# EAGLE board batsim1_1 (EAGLE 7.7.0)
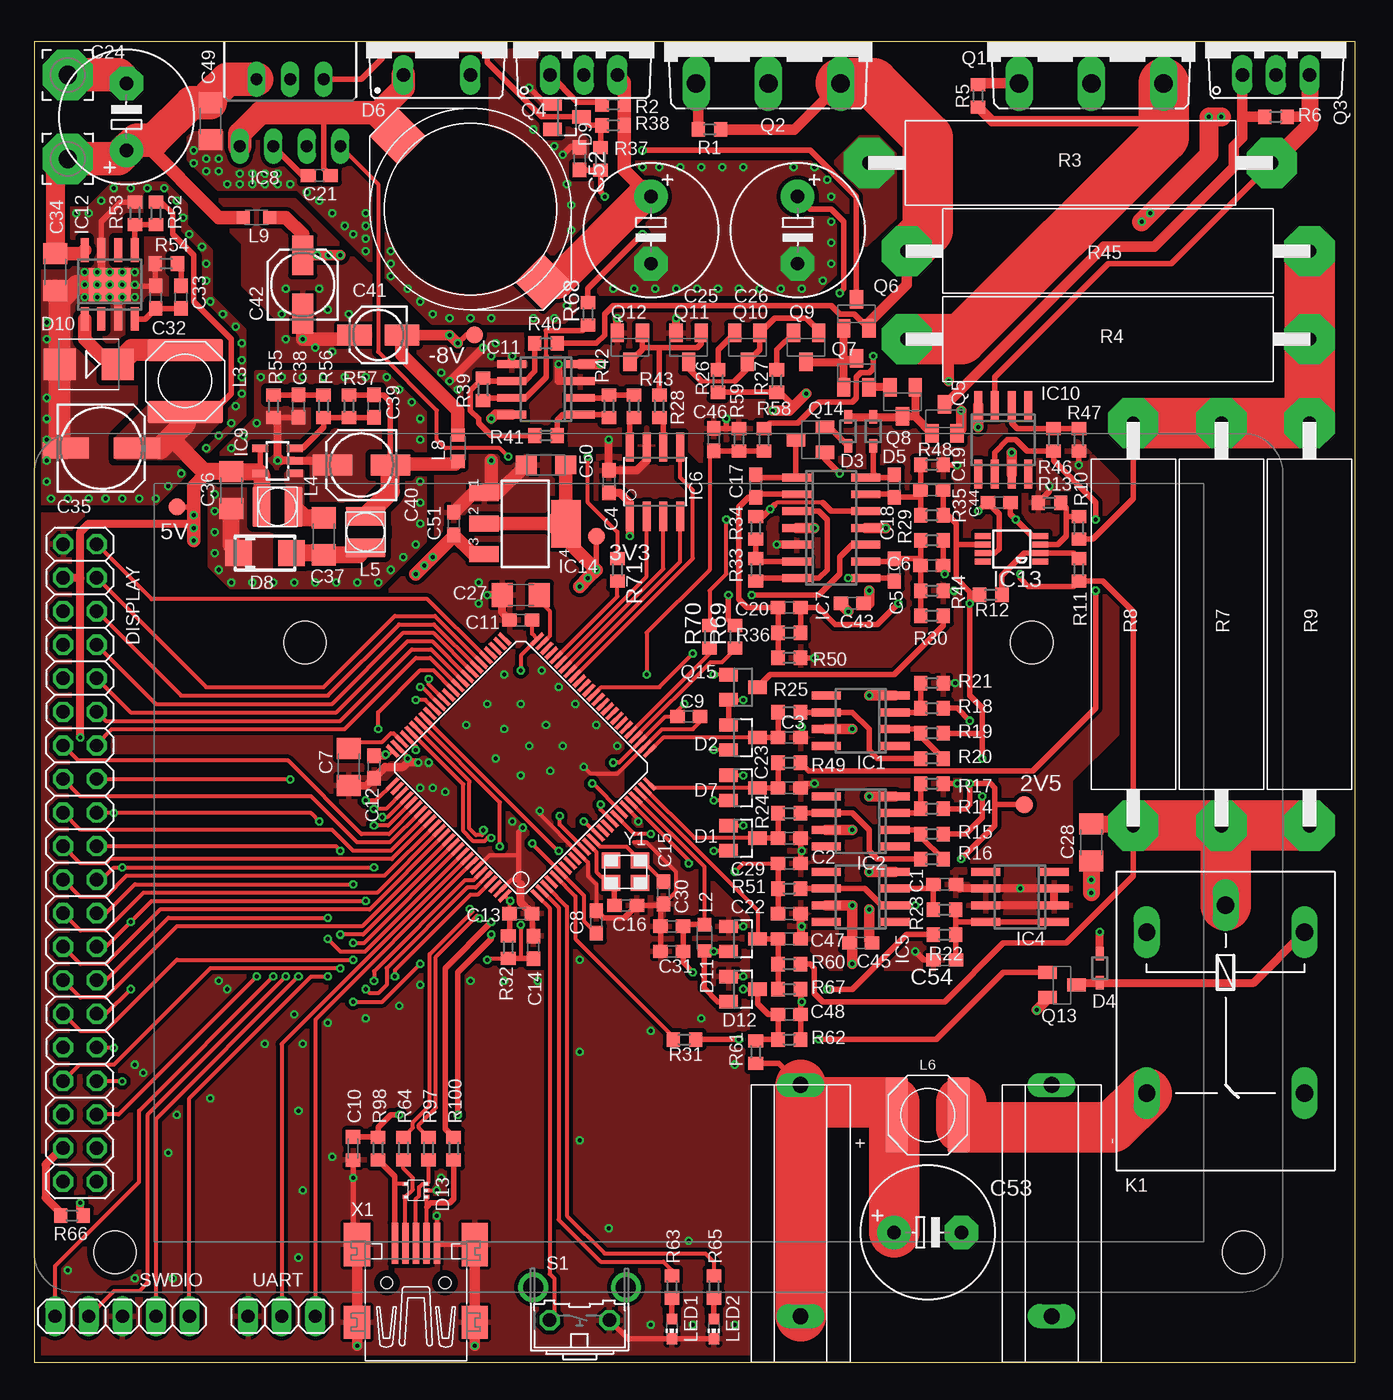
[diagram p4: board, top side]
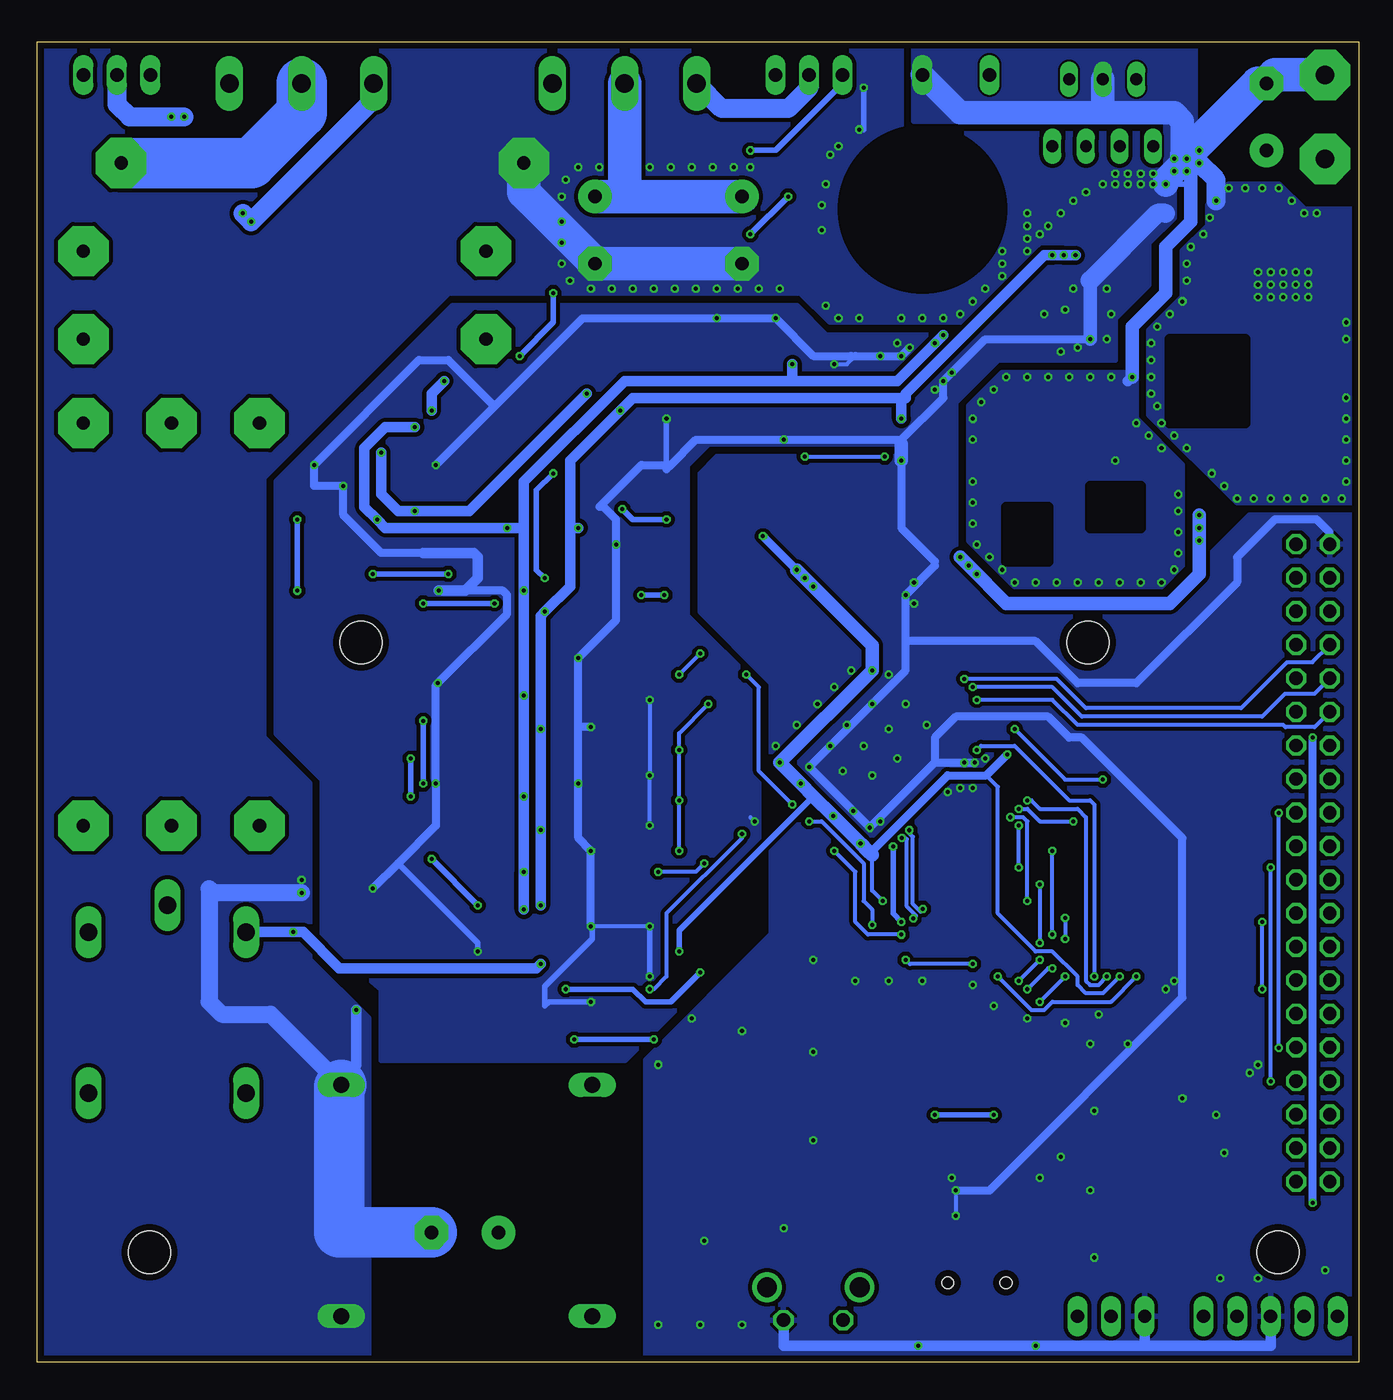
[diagram p5: board, bottom side, seen from below]

Size 100 x 100 mm. Coordinates in mm from the lower left corner, seen from the top.
Outline: 0,0 100,0 100,100 0,100 0,0
Copper layers (1*16): Top 0.035mm / dielectric 1.6mm / Bottom 0.035mm
Design rules "Elecrow_2-layer_PCB_eagle_rule *": minimum track width 6mil, minimum drill 12mil, track to track 6mil, track to pad 6mil, pad to pad 6mil, via to via 8mil, smd to smd 0mil, copper to edge 20mil, drill to drill 10mil, minimum pad ring 6mil, minimum via ring 6mil, stop-mask expansion 0mil, vias tented up to drill 100mil, thermal gap 10mil
Holes 3.2 mm at 20.5,54.5 75.5,54.5 91.52,8.33 6.11,8.33
tKeepout: area 72.5,51.5 to 78.5,57.5; area 17.5,51.5 to 23.5,57.5
tRestrict: area 8.3,73 to 14.3,75.6; area 26.9,81.2 to 39.1,93.4; area 18.1,63.2 to 18.7,66.4; area 23.5,62.5 to 26.7,63.2; area 17.5,51.5 to 23.5,57.5; area 72.5,51.5 to 78.5,57.5
bRestrict: area 8.6,71.1 to 14.3,77.5; area 26.9,81.2 to 39.1,93.4; area 16.5,63.2 to 20.3,66.4; area 23.5,60.6 to 26.7,64.8

## Footprints (pad centres in the part's own frame; a part is rotated, then mirrored left to right if it is on the bottom)
B1,27 = smd 1.27 x 1.27: TP 0,0
4MMJACK = drill 1.2 long: 1@1 0,0; 1@2 17.5,0
C0603 = smd 1.1 x 1: 1 -0.85,0; 2 0.85,0
C1206 = smd 1.6 x 1.8: 1 -1.4,0; 2 1.4,0
C0603K = smd 1.05 x 1.08: 1 -0.875,0; 2 0.875,0
E5-10,5 = drill 1.016 pad 2.54: + -2.54,0 | drill 1.016 pad 2.54 octagon: - 2.54,0
153CLV-0605 = smd 3.5 x 1.6: + 2.7,0; - -2.7,0
153CLV-0505 = smd 3 x 1.6: + 2.2,0; - -2.2,0
153CLV-0405 = smd 2.6 x 1.6: + 1.8,0; - -1.8,0
SMC_A = smd 1.6 x 1.4: + -1.5,0; - 1.5,0
SOT23 = smd 1 x 1.4: 1 -0.95,-1.1; 2 0.95,-1.1; 3 0,1.1
SOD323 = smd 1 x 0.6: 1 -1.1,0; 2 1.1,0
TO220ACS = drill 1.016 long: A 2.54,0; C -2.54,0
SMA = smd 2 x 2: A 2,0; C -2,0
SMB = smd 2.4 x 2.4: A 2.2,0; C -2.2,0
SOT-665 = smd 0.3 x 0.4: 1 -0.5,-0.8; 2 0,-0.8; 3 0.5,-0.8; 4 0.5,0.8; 5 -0.5,0.8
SAINSMART_TFT_3.2 = drill 1.016 octagon: 1 2.19,56.63; 2 4.73,56.63; 3 2.19,54.09; 4 4.73,54.09; 5 2.19,51.55; 6 4.73,51.55; 7 2.19,49.01; 8 4.73,49.01; 9 2.19,46.47; 10 4.73,46.47; 11 2.19,43.93; 12 4.73,43.93; 13 2.19,41.39; 14 4.73,41.39; 15 2.19,38.85; 16 4.73,38.85; 17 2.19,36.31; 18 4.73,36.31; 19 2.19,33.77; 20 4.73,33.77; 21 2.19,31.23; 22 4.73,31.23; 23 2.19,28.69; 24 4.73,28.69; 25 2.19,26.15; 26 4.73,26.15; 27 2.19,23.61; 28 4.73,23.61; 29 2.19,21.07; 30 4.73,21.07; 31 2.19,18.53; 32 4.73,18.53; 33 2.19,15.99; 34 4.73,15.99; 35 2.19,13.45; 36 4.73,13.45; 37 2.19,10.91; 38 4.73,10.91; 39 2.19,8.37; 40 4.73,8.37
SO08 = smd 0.6 x 2.2: 1 -1.905,-2.6; 2 -0.635,-2.6; 3 0.635,-2.6; 4 1.905,-2.6; 5 1.905,2.6; 6 0.635,2.6; 7 -0.635,2.6; 8 -1.905,2.6
SO8 = smd 0.6 x 2.2: 1 -1.905,-2.6; 2 -0.635,-2.6; 3 0.635,-2.6; 4 1.905,-2.6; 5 1.905,2.6; 6 0.635,2.6; 7 -0.635,2.6; 8 -1.905,2.6
SO08' = smd 0.61 x 2.21: 1 -1.905,-2.616; 2 -0.635,-2.616; 3 0.635,-2.616; 4 1.905,-2.616; 5 1.905,2.616; 6 0.635,2.616; 7 -0.635,2.616; 8 -1.905,2.616
SO14 = smd 0.6 x 2.2: 1 -3.81,-2.6; 2 -2.54,-2.6; 3 -1.27,-2.6; 4 0,-2.6; 5 1.27,-2.6; 6 2.54,-2.6; 7 3.81,-2.6; 8 3.81,2.6; 9 2.54,2.6; 10 1.27,2.6; 11 0,2.6; 12 -1.27,2.6; 13 -2.54,2.6; 14 -3.81,2.6
TO220-7 = drill 0.9 long: 1 -3.81,-5.08; 2 -2.54,0; 3 -1.27,-5.08; 4 0,0; 5 1.27,-5.08; 6 2.54,0; 7 3.81,-5.08
SOT23-5 = smd 0.55 x 1.2: 1 -0.95,-1.3; 2 0,-1.3; 3 0.95,-1.3; 4 0.95,1.3; 5 -0.95,1.3
HSOP8 = smd 0.6 x 1.8: 1 -1.905,-2.6; 2 -0.635,-2.6; 3 0.635,-2.6; 4 1.905,-2.6; 5 1.905,2.6; 6 0.635,2.6; 7 -0.635,2.6; 8 -1.905,2.6 | smd 3.2 x 2.51: EXP 0,0
UMAX8 = smd 0.45 x 1.2: 1 -0.975,-2.175; 2 -0.325,-2.175; 3 0.325,-2.175; 4 0.975,-2.175; 5 0.975,2.175; 6 0.325,2.175; 7 -0.325,2.175; 8 -0.975,2.175
SOT223 = smd 1.219 x 2.235: 1 -2.311,-3.099; 2 0,-3.099; 3 2.311,-3.099 | smd 3.6 x 2.2: 4 0,3.099
G5LE = drill 1.321 long: 1 -7.493,-5.969; 2 -7.493,5.969; O 4.699,5.969; P -9.525,0; S 4.699,-5.969
PISR = smd 3 x 3: 1 -7.8,0; 2 7.8,0
L2012C = smd 1 x 1: 1 -1,0; 2 1,0
L_NR60XX = smd 5.7 x 1.7: 1 0,2.35; 2 0,-2.35
L_1212 = smd 3 x 1.4: 1 0,1.2; 2 0,-1.2
CHIP-LED0603 = smd 0.8 x 0.8: A 0,-0.75; C 0,0.75
3,81/1,4 = drill 1.397 pad 3.81 octagon: 1 0,0
TOP3AV = drill 1.397 long: B -5.461,-3.175; C 0,-3.175; E 5.461,-3.175
TO220AV = drill 1.016 long: B -2.54,-2.54; C 0,-2.54; E 2.54,-2.54
SOT23-BEC = smd 1 x 1.4: B -0.95,-1.1; C 0,1.1; E 0.95,-1.1
R0603 = smd 1 x 1.1: 1 -0.85,0; 2 0.85,0
5WAXIAL = drill 1 pad 3.81 octagon: 1 15.24,0; 2 -15.24,0
B3F-31XX = drill 1.016 octagon: 1 -2.261,-1.245; 2 2.261,-1.245 | drill 1.499 pad 2.159: 3 -3.505,1.245; 4 3.505,1.245
1X05 = drill 1.016 long: 1 -5.08,0; 2 -2.54,0; 3 0,0; 4 2.54,0; 5 5.08,0
LQFP100_14 = smd 1.2 x 0.3: P$1 -7.75,6; P$2 -7.75,5.5; P$3 -7.75,5; P$4 -7.75,4.5; P$5 -7.75,4; P$6 -7.75,3.5; P$7 -7.75,3; P$8 -7.75,2.5; P$9 -7.75,2; P$10 -7.75,1.5; P$11 -7.75,1; P$12 -7.75,0.5; P$13 -7.75,0; P$14 -7.75,-0.5; P$15 -7.75,-1; P$16 -7.75,-1.5; P$17 -7.75,-2; P$18 -7.75,-2.5; P$19 -7.75,-3; P$20 -7.75,-3.5; P$21 -7.75,-4; P$22 -7.75,-4.5; P$23 -7.75,-5; P$24 -7.75,-5.5; P$25 -7.75,-6; P$51 7.75,-6; P$52 7.75,-5.5; P$53 7.75,-5; P$54 7.75,-4.5; P$55 7.75,-4; P$56 7.75,-3.5; P$57 7.75,-3; P$58 7.75,-2.5; P$59 7.75,-2; P$60 7.75,-1.5; P$61 7.75,-1; P$62 7.75,-0.5; P$63 7.75,0; P$64 7.75,0.5; P$65 7.75,1; P$66 7.75,1.5; P$67 7.75,2; P$68 7.75,2.5; P$69 7.75,3; P$70 7.75,3.5; P$71 7.75,4; P$72 7.75,4.5; P$73 7.75,5; P$74 7.75,5.5; P$75 7.75,6 | smd 0.3 x 1.2: P$26 -6,-7.75; P$27 -5.5,-7.75; P$28 -5,-7.75; P$29 -4.5,-7.75; P$30 -4,-7.75; P$31 -3.5,-7.75; P$32 -3,-7.75; P$33 -2.5,-7.75; P$34 -2,-7.75; P$35 -1.5,-7.75; P$36 -1,-7.75; P$37 -0.5,-7.75; P$38 0,-7.75; P$39 0.5,-7.75; P$40 1,-7.75; P$41 1.5,-7.75; P$42 2,-7.75; P$43 2.5,-7.75; P$44 3,-7.75; P$45 3.5,-7.75; P$46 4,-7.75; P$47 4.5,-7.75; P$48 5,-7.75; P$49 5.5,-7.75; P$50 6,-7.75; P$76 6,7.75; P$77 5.5,7.75; P$78 5,7.75; P$79 4.5,7.75; P$80 4,7.75; P$81 3.5,7.75; P$82 3,7.75; P$83 2.5,7.75; P$84 2,7.75; P$85 1.5,7.75; P$86 1,7.75; P$87 0.5,7.75; P$88 0,7.75; P$89 -0.5,7.75; P$90 -1,7.75; P$91 -1.5,7.75; P$92 -2,7.75; P$93 -2.5,7.75; P$94 -3,7.75; P$95 -3.5,7.75; P$96 -4,7.75; P$97 -4.5,7.75; P$98 -5,7.75; P$99 -5.5,7.75; P$100 -6,7.75
1X03 = drill 1.016 long: 1 -2.54,0; 2 0,0; 3 2.54,0
32005-301 = smd 3.1 x 0.5: 1 3,1.6; 2 3,0.8; 3 3,0; 4 3,-0.8; 5 3,-1.6 | smd 2.5 x 2: M1 -3,-4.45; M2 -3,4.45 | smd 3.3 x 2: M3 2.9,4.45; M4 2.9,-4.45 | hole 0.9: 0,2.2; 0,-2.2
3.2X2.5MM = smd 1.4 x 1.2: 1 -1.1,-0.85; 2 1.1,-0.85; 3 1.1,0.85; 4 -1.1,0.85

## Placement (x,y rotation side)
2V5  TPB1,27  [B1,27]  74.93,42.23 0 top
3V3  TPB1,27  [B1,27]  42.55,62.55 0 top
5V  TPB1,27  [B1,27]  10.79,64.77 0 top
+  [4MMJACK]  58,21 270 top
-  [4MMJACK]  77,21 270 top
-8V  TPB1,27  [B1,27]  33.34,77.79 0 top
C1  1u  [C0603]  68.9,36.2 0 top
C2  330p  [C0603]  57.15,39.69 0 top
C3  330p  [C0603]  57.15,47.31 0 top
C4  100n  [C0603]  43.5,66.67 270 top
C5  100p  [C0603]  65.09,60.01 270 top
C6  100p  [C0603]  67.94,60.33 0 top
C7  2u2  [C1206]  23.81,45.09 270 top
C8  100n  [C0603]  42.55,33.34 90 top
C9  100n  [C0603]  49.53,48.9 0 top
C10  100n  [C0603K]  24.13,16.19 270 top
C11  100n  [C0603]  36.83,56.2 180 top
C12  100n  [C0603]  25.72,45.09 270 top
C13  100n  [C0603]  36.83,33.97 0 top
C14  100n  [C0603]  37.78,31.43 90 top
C15  12p  [C0603]  47.62,35.56 90 top
C16  12p  [C0603]  44.77,34.61 180 top
C17  10n  [C0603]  54.61,66.36 90 top
C18  10n  [C0603]  65.09,66.36 90 top
C19  200p  [C0603]  67.94,66.04 0 top
C20  100p  [C0603]  57.15,57.15 0 top
C21  10n  [C0603]  21.59,89.85 0 top
C22  100n  [C0603]  57.15,33.97 0 top
C23  10n  [C0603]  57.15,43.5 0 top
C24  820u/35V  [E5-10,5]  6.99,94.3 90 top
C25  820u/35V  [E5-10,5]  46.67,85.72 270 top
C26  820u/35V  [E5-10,5]  57.78,85.72 270 top
C27  2u2  [C1206]  36.83,58.1 180 top
C28  100n  [C1206]  80.01,39.37 90 top
C29  1u  [C0603]  57.15,37.78 0 top
C30  100n  [C0603]  48.26,33.02 180 top
C31  1u  [C0603]  48.26,31.11 180 top
C32  220p  [C0603]  9.21,80.64 90 top
C33  22n  [C0603]  11.11,80.64 90 top
C34  10u/50V  [C1206]  1.59,82.55 90 top
C35  330u  [153CLV-0605]  5.08,69.22 0 top
C36  10u/50V  [C1206]  14.92,66.04 90 top
C37  1u/25V  [C1206]  21.91,62.55 90 top
C38  1u  [C0603]  20,72.39 270 top
C39  1n  [C0603]  25.72,72.39 270 top
C40  22u  [153CLV-0505]  24.77,67.94 180 top
C41  10u  [153CLV-0405]  26.04,77.79 180 top
C42  10u  [153CLV-0505]  20.32,81.6 90 top
C43  1u/50V  [C0603]  61.91,57.47 0 top
C44  1u/50V  [C0603]  73.03,65.09 0 top
C45  1u/50V  [C0603]  62.55,31.75 0 top
C46  1n5  [C0603]  51.44,69.85 90 top
C47  1n5  [C0603]  57.15,32.07 0 top
C48  330p  [C0603]  57.15,26.35 0 top
C49  470n/50V  [C1206]  13.34,93.98 270 top
C50  10µ  [SMC_A]  38.73,67.94 180 top
C51  100n  [C0603]  31.75,63.5 90 top
C52  1u  [C0603]  41.27,91.12 270 top
C53  220u  [E5-10,5]  67.63,9.84 0 top
C54  100n  [C0603]  68.9,30.48 180 top
D1  BAT54S  [SOT23]  53.66,39.69 270 top
D2  BAT54S  [SOT23]  53.66,47.31 270 top
D3  1N4148  [SOD323]  61.59,70.48 90 top
D4  1N4148  [SOD323]  80.64,29.84 270 top
D5  1N4148  [SOD323]  63.5,70.48 90 top
D6  MBR745  [TO220ACS]  30.48,97.47 0 top
D7  BAT54S  [SOT23]  53.66,43.5 270 top
D8  [SMA]  17.46,61.28 0 top
D9  BAT54S  [SOT23]  40.32,94.3 270 top
D10  B240F  [SMB]  4.13,75.56 180 top
D11  BAT54S  [SOT23]  53.66,32.07 270 top
D12  BAT54S  [SOT23]  53.66,28.26 270 top
D13  BZA900AVL  [SOT-665]  28.89,13.02 90 top
DISPLAY  SAINSMART_TFT_3.2  [SAINSMART_TFT_3.2]  0,5.32 0 top
IC1  OP07CR  [SO08]  62.55,48.58 90 top
IC2  OP07CR  [SO08]  62.55,40.96 90 top
IC4  TL431ACD  [SO8]  74.61,35.24 90 top
IC5  OP07CR  [SO08]  62.55,35.24 90 top
IC6  MCP4812  [SO08']  46.99,66.67 0 top
IC7  TL084D  [SO14]  60.33,63.18 270 top
IC8  LM2678T  [TO220-7]  19.37,97.16 0 top
IC9  LM2611  [SOT23-5]  18.41,68.26 90 top
IC10  OP07CR  [SO08]  73.34,69.85 180 top
IC11  TL072D  [SO08]  38.73,73.66 90 top
IC12  L5973D  [HSOP8]  5.71,81.6 0 top
IC13  MAX44241  [UMAX8]  73.98,61.59 90 top
IC14  [SOT223]  37.15,63.5 270 top
K1  G5LE  [G5LE]  90.17,25.08 270 top
L1  47u  [PISR]  33.02,87.31 315 top
L2  4u7  [L2012C]  50.72,32.14 90 top
L3  22u  [L_NR60XX]  11.43,74.3 0 top
L4  22u  [L_1212]  18.41,64.77 90 top
L5  22u  [L_1212]  25.08,62.87 180 top
L6  2u2/6.1A  [L_NR60XX]  67.63,18.73 270 top
L8  4u7  [L2012C]  32.07,69.22 90 top
L9  4u7  [L2012C]  16.83,86.68 0 top
LED1  [CHIP-LED0603]  48.26,2.54 180 top
LED2  [CHIP-LED0603]  51.44,2.54 180 top
PAD1  [3,81/1,4]  2.54,91.12 0 top
PAD2  [3,81/1,4]  2.54,97.47 0 top
Q1  TIP2955  [TOP3AV]  80.01,100.01 0 top
Q2  TIP3055  [TOP3AV]  55.56,100.01 0 top
Q3  TIP41C  [TO220AV]  93.98,100.01 0 top
Q4  TIP42C  [TO220AV]  41.59,100.01 0 top
Q5  BC807-40SMD  [SOT23-BEC]  68.9,71.44 0 top
Q6  BC817-40SMD  [SOT23-BEC]  62.23,79.38 0 top
Q7  BC817-40SMD  [SOT23-BEC]  62.23,74.93 0 top
Q8  BC807-40SMD  [SOT23-BEC]  65.72,72.71 180 top
Q9  BC807-40SMD  [SOT23-BEC]  58.42,76.83 180 top
Q10  BC807-40SMD  [SOT23-BEC]  53.98,76.83 180 top
Q11  BC817-40SMD  [SOT23-BEC]  49.53,76.83 180 top
Q12  BC817-40SMD  [SOT23-BEC]  45.09,76.83 180 top
Q13  BC817-40SMD  [SOT23-BEC]  77.79,28.57 270 top
Q14  BC807-40SMD  [SOT23-BEC]  58.74,69.85 90 top
Q15  BSS123  [SOT23]  53.66,51.12 270 top
R1  100  [R0603]  51.12,93.34 180 top
R2  1k5  [R0603]  43.81,95.25 0 top
R3  0.1/5W  [5WAXIAL]  81.28,84.14 0 top
R4  0.1/5W  [5WAXIAL]  81.28,77.47 180 top
R5  100  [R0603]  71.44,95.89 270 top
R6  1k5  [R0603]  93.98,94.3 0 top
R7  0.33/5W  [5WAXIAL]  89.85,55.88 270 top
R8  0.33/5W  [5WAXIAL]  83.19,55.88 270 top
R9  0.33/5W  [5WAXIAL]  96.52,55.88 270 top
R10  1k  [R0603]  79.06,63.18 270 top
R11  1k  [R0603]  79.06,60.01 270 top
R12  15k  [R0603]  72.39,58.1 0 top
R13  15k  [R0603]  76.83,65.09 0 top
R14  15k  [R0603]  67.94,41.91 0 top
R15  12k  [R0603]  67.94,40.01 0 top
R16  3k  [R0603]  67.94,38.1 0 top
R17  10k  [R0603]  67.94,43.81 0 top
R18  12k  [R0603]  67.94,49.53 0 top
R19  12k  [R0603]  67.94,47.62 0 top
R20  30k  [R0603]  67.94,45.72 0 top
R21  2k  [R0603]  67.94,51.44 0 top
R22  750  [R0603]  68.9,32.38 0 top
R23  10k  [R0603]  68.9,34.29 180 top
R24  3k3  [R0603]  57.15,41.59 0 top
R25  3k3  [R0603]  57.15,49.21 0 top
R26  1k  [R0603]  51.75,74.3 270 top
R27  1k  [R0603]  56.2,74.3 270 top
R28  1k  [R0603]  47.31,72.39 270 top
R29  12k  [R0603]  67.94,62.23 0 top
R30  2k  [R0603]  67.94,56.52 180 top
R31  10k  [R0603]  49.21,24.45 0 top
R32  10k  [R0603]  35.88,31.43 90 top
R33  100k  [R0603]  54.61,60.01 90 top
R34  100k  [R0603]  54.61,63.18 90 top
R35  1k  [R0603]  67.94,64.14 0 top
R36  1k  [R0603]  57.15,55.24 0 top
R37  910  [R0603]  42.86,91.12 90 top
R38  3k6  [R0603]  43.81,93.66 0 top
R39  10k  [R0603]  33.97,73.66 270 top
R40  36k  [R0603]  38.73,77.15 180 top
R41  36k  [R0603]  38.73,70.17 180 top
R42  20k  [R0603]  43.5,72.39 270 top
R43  10k  [R0603]  45.4,72.39 90 top
R44  12k  [R0603]  67.94,58.42 180 top
R45  0.1/5W  [5WAXIAL]  78.42,90.81 180 top
R46  100k  [R0603]  77.15,69.85 90 top
R47  1k  [R0603]  79.06,69.85 270 top
R48  1k  [R0603]  67.94,67.94 180 top
R49  10k  [R0603]  57.15,45.4 0 top
R50  1k  [R0603]  57.15,53.34 180 top
R51  47  [R0603]  57.15,35.88 0 top
R52  10k  [R0603]  9.21,87 90 top
R53  3k3  [R0603]  7.62,87 270 top
R54  4k7  [R0603]  10,83.19 0 top
R55  9k1  [R0603]  18.1,72.39 90 top
R56  1k  [R0603]  21.91,72.39 270 top
R57  56k  [R0603]  23.81,72.39 90 top
R58  100k  [R0603]  55.24,69.85 270 top
R59  10k  [R0603]  53.34,69.85 90 top
R60  75k  [R0603]  57.15,30.16 180 top
R61  360k  [R0603]  54.61,23.5 90 top
R62  47k  [R0603]  57.15,24.45 0 top
R63  1k  [R0603]  48.26,5.71 270 top
R64  22  [R0603]  27.94,16.19 90 top
R65  1k  [R0603]  51.44,5.71 270 top
R66  27  [R0603]  2.86,11.11 180 top
R67  10k  [R0603]  57.15,28.26 0 top
R68  91  [R0603]  41.91,79.38 90 top
R69  1k  [R0603]  53.02,54.93 90 top
R70  1k  [R0603]  51.12,54.93 90 top
R71  1k  [R0603]  44.13,60.01 270 top
R97  22  [R0603]  29.84,16.19 90 top
R98  10k  [R0603]  26.04,16.19 90 top
R100  22  [R0603]  31.75,16.19 90 top
S1  [B3F-31XX]  41.27,4.45 0 top
SWDIO  [1X05]  6.67,3.49 180 top
U$1  STM32F407X100  [LQFP100_14]  36.85,45.05 135 top
UART  [1X03]  18.73,3.49 0 top
X1  MINI-USB-SHIELD-32005-301  [32005-301]  28.89,6.03 90 top
Y1  CRYSTAL.3.2X2.5MM  [3.2X2.5MM]  44.77,37.15 180 top

## Tracks (layer width: path | path; a pad name or v marks a point on that pad's centre or on a via)
2.5V  (via drill 0.3)
  Top 0.406: R51.2 IC5.6 62.87,35.88 64.14,34.61 IC5.2 v66.67,34.61 | R14.2 70.48,41.91 70.8,42.23 v70.8,43.81 72.39,43.81 72.71,43.5 72.71,42.23 | v70.17,38.1 72.71,40.64 72.71,42.23 | R18.2 69.85,49.53 v70.8,48.58 | 2V5.TP 72.71,42.23
  Bottom 0.406: v70.8,43.81 v70.8,48.58 | v66.67,34.61 v70.17,38.1
+3V3  (via drill 0.3)
  Top 0.305: C11.1 37.68,55.17 U$1.P$50 36.83,53.52 v36.83,52.39 | U$1.P$75 26.77,45.94 C12.1 | C13.1 35.98,34.95 U$1.P$100 36.01,34.92 v36.04,34.92 | v43.81,45.4 44.27,45.4 U$1.P$28 47.77,48.9 C9.1 48.68,49.31 v49.21,49.85 | U$1.P$11 39.77,40.71 v39.77,41.35 | U$1.P$19 42.32,43.81 v42.23,43.81 | D1.2 v51.44,38.74 v51.44,38.73 | D2.2 v51.44,46.35 | D7.2 v51.44,42.55 | C8.1 41.59,33.44 41.59,35.35 U$1.P$6 37.7,39.24 v37.7,39.29 | SWDIO.5 1.59,7.3 7.94,13.65 7.94,19.05 v18.1,29.21
  Top 0.406: R32.2 35.98,32.38 C13.1 | D12.2 51.75,27.31 50.72,28.34 L2.1 50.75,31.12 D11.2 v51.44,31.11 50.8,31.11 | 3V3.TP v42.55,60.01
  Top 0.61: C4.2 44.35,65.83 45.09,65.09 IC6.1 v45.09,62.55 | C12.1 26.49,45.94 v26.59,46.04
  Top 1.016: IC14.2 39.05,63.5 | 39.05,63.5 v42.55,60.01 v41.91,59.37 v41.27,58.74 | C50.+ 40.23,64.68 39.05,63.5
  Bottom 0.305: v36.04,34.92 36.83,35.72 36.83,38.42 | v51.44,38.73 v51.44,42.55 v51.44,46.35 51.44,47.62 v49.21,49.85 | v18.1,29.21 19.37,27.94 20.64,27.94 21.27,28.57 21.27,29.21 23.18,31.11 24.45,31.11 27.3,33.97 27.3,43.58 28.18,44.45
  Bottom 0.406: v51.44,31.11 51.44,32.7 41.27,42.86
  Bottom 0.61: v45.09,62.55 v42.55,60.01 | 37.15,38.73 36.83,38.73 31.11,44.45 28.18,44.45 v26.59,46.04
  Bottom 1.016: 36.83,38.42 37.15,38.73 v37.7,39.29 v39.77,41.35 41.27,42.86 v42.23,43.81 v43.81,45.4 v36.83,52.39 36.83,54.29 v42.55,60.01
+5V  (via drill 0.3)
  Top 0.406: R52.2 9.63,87.84 10.48,87 10.48,85.41 12.06,83.82 12.06,80.33 14.92,77.47 14.92,73.34 13.34,71.75 11.62,71.75 L3.2 | IC9.5 IC9.4 | 5V.TP 12.06,64.77
  Top 0.61: R66.1 3.49,11.33 v3.49,12.06 | 3.49,59.37 3.49,62.87 4.13,63.5 11.75,63.5 v12.06,63.18 | 3.38,59.49 3.46,59.41 | v3.49,47.31 3.49,59.37 | DISPLAY.3 3.46,59.41 | 3.46,59.41 3.49,59.37
  Top 1.016: 12.89,67.44 12.89,67.18 12.06,66.36 12.06,64.77 v12.06,64.14 v12.06,63.18 v12.06,62.23 | IC14.3 33.21,61.19 C51.1 31.75,62.55 v29.53,60.33 v28.89,59.69
  Top 1.27: 10.32,70.01 12.89,67.44 C36.2 16.99,67.44 IC9.5 17.21,67.21 L4.1
  Top 1.676: 11.43,71.12 10.32,70.01 9.53,69.22
  Bottom 0.61: v3.49,12.06 v3.49,47.31
  Bottom 1.016: v12.06,64.14 12.06,59.69 14.29,57.47 26.67,57.47 v29.53,60.33 v30.16,60.96
  pour Top (isolate 0.305, no thermals): 6.35,69.85 8.89,72.39 13.97,72.39 13.97,71.44 11.11,68.58 6.35,68.58
+24V  (via drill 0.3)
  Top 0.406: R26.2 R27.2 56.41,73.44 57.47,72.39 | 72.39,64.87 C44.1 | C44.1 72.07,65.09 v71.44,64.45 | C44.1 73.03,64.24 73.03,61.59 72.7,61.27 IC13.7
  Top 0.61: D4.1 v80.64,32.58
  Top 0.813: IC11.8 34.92,71.75 v34.61,71.44 | IC1.7 v61.91,47.94 | IC2.7 v61.91,40.32 | IC5.7 v61.91,34.61 | v55.88,72.07 57.15,72.07 57.47,72.39 v58.42,73.34 | v73.98,68.9 IC10.7 | IC7.4 v59.05,63.18 | C43.1 61.06,57.37 v61.59,56.83 | C45.1 61.91,31.96 v61.91,34.61 | v61.91,30.16 v61.91,34.61 | C42.+ 20.34,83.82 v23.18,83.82
  Top 1.016: C42.+ 20.32,85.41 19.05,86.68 L9.2
  Bottom 0.813: 34.61,73.03 34.29,73.03 34.29,73.34 23.81,83.82 v23.18,83.82 v22.3,83.82 v21.43,83.82 | 34.61,73.03 54.93,73.03 v55.88,72.07 59.69,68.26 59.69,63.18 | 59.69,63.18 59.69,58.74 v61.59,56.83 61.91,56.52 v61.91,47.94 v61.91,40.32 v61.91,34.61 | v34.61,71.44 34.61,73.03 | v58.42,73.34 67.31,64.45 v71.44,64.45 72.71,64.45 73.98,65.72 v73.98,68.9 | v59.05,63.18 59.69,63.18 | K1.1 v80.64,32.58 79.88,32.58 77.15,29.84 62.23,29.84 v61.91,30.16
-8V  (via drill 0.3)
  Top 0.406: IC10.4 71.44,72.07 | C44.2 73.88,64.21 74.27,63.82 v74.3,63.82 | 74.3,63.79 v74.3,63.82 | -8V.TP 32.7,77.79 v32.07,77.15 | 74.61,63.5 v74.3,63.82 | IC13.4 75.54,62.57 v74.3,63.82
  Top 0.813: C41.- v31.43,77.79 v32.07,77.15 | IC11.4 v42.86,75.56 | IC1.4 v63.18,50.48 | IC2.4 v63.18,42.86 | IC5.4 v63.18,37.15 | v71.44,70.8 IC10.4 | IC7.11 v64.45,63.18 | C43.2 63.18,57.47 v63.18,58.42 | C45.2 63.18,31.96 v63.18,34.29
  Top 1.016: C41.- 27.84,76.31 32.07,72.07 L8.2
  Bottom 0.813: v31.43,77.79 34.92,74.3 42.86,74.3 | 42.86,74.3 55.56,74.3 63.18,66.67 63.18,63.18 | 63.18,63.18 v63.18,58.42 v63.18,50.48 v63.18,42.86 v63.18,37.15 v63.18,34.29 | v42.86,75.56 42.86,74.3 | 63.18,63.18 v64.45,63.18 73.66,63.18 v74.3,63.82 75.25,64.77 75.25,69.22 73.66,70.8 v71.44,70.8
ADC_BATTERY  (via drill 0.3)
  Top 0.305: U$1.P$18 45.42,40.01 v46.67,40.01 | v53.66,28.26 D12.3
  Top 0.406: D12.3 54.76,27.16 55.56,26.35 C48.1 R62.1 54.71,24.45 R61.2
  Bottom 0.305: v53.66,28.26 53.34,28.26 52.39,29.21 52.39,33.97 46.67,39.69 v46.67,40.01
ADC_BIAS_CURRENT
  Top 0.305: D7.3 46.88,43.5 U$1.P$25
  Top 0.406: D7.3 C23.1 R49.1
ADC_HIGH_CURRENT
  Top 0.305: D1.3 49.98,39.69 U$1.P$24
  Top 0.406: D1.3 C2.1 R24.1
ADC_LOW_CURRENT
  Top 0.305: D2.3 47.59,47.31 U$1.P$26
  Top 0.406: D2.3 C3.1 R25.1
ADC_PUSHPULL_OUT
  Top 0.305: U$1.P$23 54.76,34.21 D11.3
  Top 0.406: D11.3 C47.1 R60.2 R67.1
ADC_SUPPLY_HIGHSIDE  (via drill 0.3)
  Top 0.305: U$1.P$17 42.86,41.86 v42.86,42.23 | C46.1 51.12,68.68 51.12,60.01 46.35,55.24 v46.35,52.07
  Top 0.406: C46.1 R59.1 R58.2
  Bottom 0.305: v42.86,42.23 45.4,44.77 45.4,51.12 v46.35,52.07
BATTERY+
  Top 0.406: R61.1 56.35,22.64 +.1@1
  Top 2.54: L6.2 65.28,17.02 65.09,16.83
  Top 3.81: +.1@2 58,19.68 | 58,19.68 +.1@1 | 58,19.68 65.09,19.68 65.09,16.83 C53.+
BIAS_CTRL
  Top 0.406: IC6.6 47.62,71.22 R28.2
BIAS_CURRENT
  Top 0.61: Q7.B 61.28,75.88 | 61.28,75.88 Q6.B | Q7.C 62.08,75.88 61.28,75.88 | Q9.C 61.13,75.73 61.28,75.88
BUCK_ENABLE  (via drill 0.3)
  Top 0.305: IC8.7 26.04,89.22 26.04,76.52 30.48,72.07 30.48,69.85 31.11,69.22 35.24,69.22 v35.88,68.58 | v41.91,68.58 41.91,65.09 44.13,62.87 R71.1
  Bottom 0.305: v41.91,68.58 v35.88,68.58
CURRENT_CTRL  (via drill 0.3)
  Top 0.305: 59.69,65.09 56.2,65.09 56.04,64.93 | v52.39,63.82 52.39,59.69 51.12,58.42 R70.2
  Top 0.406: IC7.12 60.33,64.45 59.69,65.09 | 56.04,64.93 v55.72,64.61 55.14,64.03 R34.2
  Bottom 0.406: v52.39,63.82 54.93,63.82 v55.72,64.61
CURRENT_SENSE  (via drill 0.3)
  Top 0.406: C19.2 R35.2 69.14,64.14 69.77,63.5 69.77,61.91 | 69.77,61.91 69.77,59.37 70.8,58.34 70.8,58.1 | R36.2 C20.2 59.37,57.15 60.64,55.88 63.82,55.88 v65.41,57.47 | R19.2 71.75,47.62 | R15.2 70.48,40.01 71.75,41.27 v71.75,42.86 | v71.75,45.72 71.75,47.62 | 71.75,47.62 71.75,49.53 70.8,50.48 v70.8,57.47 70.8,58.1 | R12.1 70.8,58.1 | IC13.6 69.78,61.92 69.77,61.91
  Bottom 0.406: v65.41,57.47 v70.8,57.47 | v71.75,42.86 v71.75,45.72
DAC_CS
  Top 0.305: U$1.P$45 46.35,59.51 IC6.2
DAC_LDAC
  Top 0.305: U$1.P$42 49.85,60.88 49.85,66.04 48.9,66.99 IC6.5
DAC_SCK
  Top 0.305: U$1.P$44 47.62,60.07 IC6.3
DAC_SDI
  Top 0.305: U$1.P$43 48.9,60.63 IC6.4
GND  (via drill 0.3)
  Top 0.305: 28.26,45.4 28.26,45.86 U$1.P$74 | 36.83,36.2 36.51,36.51 36.09,36.51 U$1.P$99 | C9.2 50.38,48.48 49.85,47.94 47.52,47.94 U$1.P$27 44.13,44.55 42.12,44.55 v41.59,45.09 | U$1.P$20 45.72,41.12 v45.72,40.96 | Q15.2 v53.66,50.16 | v53.66,44.45 D7.1 | D1.1 v53.66,40.64 | U$1.P$94 34.46,38.42 36.67,38.42 | C15.1 48.58,35.66 48.58,37.15 46.35,39.37 45.4,39.37 | D11.1 v53.66,33.02 | C30.2 47.62,33.23 | D13.2 v30.48,13.02 | v30.48,11.11 30.48,9.04 X1.5 | v38.26,41.75 38.26,41.51 U$1.P$10 41.91,37.86 41.91,36.83 42.55,36.2 C8.2
  Top 0.406: R53.1 6.57,87.84 5.08,86.36 IC12.7 | R54.1 9.15,81.55 C32.2 5.82,81.5 IC12.EXP | C38.2 R55.1 | D9.1 38.74,95.25 v37.47,96.52 | R50.1 v59.05,53.34 | C23.2 58.32,43.81 v59.05,43.81 | C3.2 58.1,47.41 v58.1,48.1 | R48.1 v69.85,67.94 | R47.2 v79.06,67.94 | R21.2 v69.69,51.44 | R17.2 v69.85,43.81 | C29.2 58,38.63 v58.1,38.73 58,38.84 C2.2 | C46.2 52.28,70.7 52.39,70.8 | 52.39,70.8 v52.39,71.44 | R59.2 52.49,70.7 52.39,70.8 | C14.2 37.68,32.38 C13.2 | D2.1 Q15.2 | 36.51,36.51 36.67,36.67 36.67,38.42 36.67,40.16 v36.99,40.48 | 47.52,34.61 C16.1 44.66,33.66 43.08,33.66 C8.2 | 47.52,34.61 C15.1 | D12.1 v53.66,29.21 | C31.2 C30.2 47.41,34.49 47.52,34.61 | R62.2 C48.2 58,27.41 | X1.M4 30.59,8.93 X1.5 | LED2.C LED1.C 44.95,1.79 S1.2 | C10.2 24.13,9.24 X1.M3 | R44.1 v69.61,58.42 | R13.1 76.83,65.94 v76.83,66.36 | R67.2 58,27.41 | 58,27.41 v58.1,27.3 | v40.01,91.44 40.64,92.08 41.27,92.08 | C54.2 67.31,30.48 v66.67,31.11
  Top 0.61: IC12.7 5.08,81.92 v4.76,81.6 | IC12.3 6.35,80.96 IC12.EXP | C40.+ 22.25,68.26 IC9.2 18.73,68.26 18.41,68.58 18.41,71.22 R55.1 | IC6.7 46.35,68.26 45.62,67.53 C4.1 v43.5,69.85 | IC11.5 36.13,76.14 v36.2,76.2 | v33.97,76.83 v31.43,74.3 | IC11.3 39.69,74.3 v39.69,75.56 | Q12.E v44.13,79.06 | Q11.E v48.58,79.06 | IC7.5 v56.2,61.91 | IC4.7 IC4.2 IC4.3 v74.61,35.88 IC4.6 70.06,35.88 C1.2 | C47.2 58,32.92 v58.1,33.02 58,33.12 C22.2 | C7.2 25.17,43.69 C12.2 26.57,45.09 27.94,45.09 28.26,45.4 v29.05,45.4 | C13.2 36.83,34.82 36.83,36.2 | C11.2 35.43,56.75 C27.2 v34.29,58.1
  Top 0.813: Q13.E 76.69,27.48 v75.88,26.67 | X1.M3 X1.M2 v24.44,1.27 v24.45,1.27 | v33.34,1.27 X1.M1 X1.M4
  Top 1.016: C42.- v20.32,77.47 23.92,77.47 C41.+ | IC14.1 35.1,65.81 C50.- | IC14.1 34.61,66.37 v34.61,68.26 | C51.2 33.21,65.81 IC14.1
  Top 1.27: D8.C 14.92,61.82 C36.1 | C28.1 v80.01,35.56
  Top 1.422: IC12.EXP v4.76,81.6 3.2,81.6 1.93,80.33
  Top 1.676: C35.- 1.93,69.67 D10.A 1.93,80.33 1.93,80.81 C34.1
  Top 2.54: PAD2.1 6.35,97.47 C24.-
  Bottom 0.305: v45.72,40.96 46.04,41.27 | v53.66,50.16 v53.66,44.45 v53.66,40.64 | v53.66,33.02 v58.1,33.02 | v30.48,13.02 v30.48,11.11 | v39.69,75.56 38.73,75.56 38.1,76.2 | v36.2,76.2 38.42,76.2
  Bottom 0.406: 13.02,89.22 v14.61,89.22 | v37.47,96.52 37.47,93.34 v37.78,93.34 | v12.06,90.81 v12.06,91.76 12.7,91.76 13.34,92.39 C49.2 | v13.97,91.12 v13.02,91.12 | v52.39,71.44 52.39,67.63 | v53.66,29.21 v53.66,33.02 | v58.1,27.3 61.28,27.3 61.59,26.99 61.59,28.47 C47.2 58,32.92 v58.1,33.02 | v66.67,31.11 66.67,31.75 72.71,37.78
  Bottom 0.61: v33.97,76.83 v34.61,76.2 v36.2,76.2 38.1,76.2 38.42,76.2 41.27,76.2 v44.13,79.06 v48.58,79.06 58.74,79.06 65.25,72.55 | v20.32,77.47 28.26,77.47 v31.43,74.3 31.43,73.03 34.61,69.85 | 34.61,69.85 v43.5,69.85 50.16,69.85 52.07,67.94 | 52.39,67.63 52.07,67.94 | 59.05,48.1 v59.05,43.81 59.05,39.69 v58.1,38.73 v58.1,33.02 | 59.05,48.1 v59.05,53.34 56.2,56.2 v56.2,61.91 56.2,63.82 57.15,64.77 57.47,64.77 54.29,67.94 52.07,67.94 | v58.1,48.1 59.05,48.1 | v69.85,67.94 65.25,72.55 | 65.25,72.55 65.56,72.55 68.9,75.88 71.12,75.88 v79.06,67.94 79.06,66.36 v76.83,66.36 76.83,64.14 73.98,61.28 70.8,61.28 | v69.61,58.42 64.77,58.42 64.45,58.1 64.45,56.67 v69.69,51.44 69.85,51.28 v69.85,43.81 69.85,40.64 72.71,37.78 v74.61,35.88 | 34.61,69.85 34.61,69.53 | v34.61,68.26 34.61,63.18 32.07,60.64 32.07,60.33 v34.29,58.1 34.29,54.61 | 32.07,45.4 v36.99,40.48 v38.26,41.75 v41.59,45.09 34.29,52.39 34.29,54.61 | DISPLAY.1 2.19,62.83 3.17,63.82 6.35,63.82 9.21,60.96 9.21,59.05 16.83,51.44 21.27,51.44 24.45,54.61 34.29,54.61 | 32.07,45.4 v29.05,45.4 | v30.48,13.02 27.94,13.02 13.34,27.62 13.34,39.69 20.95,47.31 21.91,47.31 23.5,48.9 30.48,48.9 32.07,47.31 32.07,45.4
  Bottom 0.813: 17.46,74.3 v17.14,74.61 | v75.88,26.67 75.88,22.54 76.83,21.59 76.83,21.16 -.1@1 | SWDIO.3 6.67,1.27 16.19,1.27 | 16.19,1.27 v24.45,1.27 v33.34,1.27 43.5,1.27 43.5,3.16 S1.2 | UART.1 16.19,1.27 | v69.61,58.42 67.63,58.42 66.67,59.37 66.67,60.96 66.99,61.28 70.8,61.28
  Bottom 1.016: v17.14,74.61 17.14,78.42 14.61,80.96 14.61,84.45 12.7,86.36 12.7,91.76 | v20.32,77.47 20.32,81.92 | v34.61,68.26 34.61,69.53
  Bottom 1.27: v80.01,35.56 86.68,35.56 87,35.88 87,27.3 86.04,26.35 82.35,26.35 -.1@1
  Bottom 1.422: 14.61,87 15.24,87 20.32,81.92 | v10.79,87.95 10.79,89.53 v12.06,90.81
  Bottom 1.778: IC8.4 19.37,94.61 | D6.A 30.16,94.61 19.37,94.61 | 19.37,94.61 13.97,94.61 13.34,93.98 C49.2 13.34,91.44 v13.02,91.12
  Bottom 1.93: v13.02,91.12 v13.97,90.17 14.61,89.53 v14.61,89.22
  Bottom 2.54: C25.- C26.- 63.18,88.58 R45.1 | v13.02,91.12 13.02,91.44 12.7,91.76 7.62,96.84 C24.- 6.35,97.47 PAD2.1
  Bottom 3.81: C53.- 77.15,9.84 77.15,20.85 -.1@1
  other vias: 5.71,81.6 5.71,82.55 6.67,82.55 7.62,82.55 7.62,81.6 7.62,80.64 6.67,80.64 6.67,81.6 5.71,80.64 4.76,80.64 4.76,82.55 3.81,82.55 3.81,81.6 3.81,80.64 3.17,87 4.13,87 5.08,87.95 6.03,88.9 7.3,88.9 8.57,88.9 9.84,88.9 11.27,86.68 11.75,85.41 12.7,84.45 13.02,83.19 13.02,81.92 13.34,80.33 14.29,79.38 15.24,78.42 15.72,77.15 15.72,75.88 15.72,74.61 15.72,73.34 15.24,72.39 14.92,71.12 13.97,70.17 13.02,69.22 11.11,67.31 10.16,66.36 9.21,65.41 7.94,65.41 6.67,65.41 5.4,65.41 4.13,65.41 2.54,65.41 1.27,65.41 0.95,66.67 0.95,68.26 0.95,69.85 0.95,71.44 0.95,73.03 0.95,77.47 0.95,78.74 18.41,68.26 14.92,69.22 15.88,70.17 16.83,71.12 18.73,74.61 20.32,74.61 21.91,74.61 23.5,74.61 25.08,74.61 26.67,74.61 27.62,73.66 28.57,72.71 29.21,71.44 29.21,69.85 29.21,66.67 29.21,65.09 29.21,63.5 28.89,61.91 27.94,60.96 26.99,60.01 26.04,59.05 24.45,59.05 22.86,59.05 21.27,59.05 19.68,59.05 18.1,59.05 16.51,59.05 14.92,59.05 13.97,60.01 13.65,61.28 13.65,62.87 13.65,65.72 13.65,64.45 19.37,89.22 20.64,88.58 21.59,87.95 22.54,87 23.5,86.04 24.13,85.41 28.26,81.28 29.21,80.33 30.16,79.38 31.43,79.06 33.02,79.06 34.61,79.06 37.78,79.06 39.37,79.06 40.32,80.01 43.81,81.28 45.4,81.28 46.99,81.28 48.58,81.28 50.16,81.28 51.75,81.28 53.34,81.28 54.93,81.28 56.52,81.28 58.1,81.28 59.69,81.92 60.33,83.19 60.33,84.77 60.33,86.36 60.33,88.27 60.01,89.53 59.05,90.49 57.47,90.49 53.66,90.49 52.07,90.49 50.48,90.49 48.9,90.49 47.31,90.49 46.04,90.49 34.92,77.15 30.8,74.93 32.07,73.66 21.27,76.83 22.54,76.52 19.05,77.47 18.73,79.38 19.05,81.28 21.59,81.28 22.23,79.69 23.81,79.38 80.01,36.51 18.41,89.22 18.41,90.01 39.37,92.08 40.32,89.22 40.64,87.63 40.64,85.72 13.02,90.17 17.46,90.01 17.46,89.22 16.51,90.01 15.56,90.01 16.51,89.22 15.56,89.22 25.08,84.14 25.08,85.09 25.08,86.04 25.08,87 26.99,84.14 26.99,83.19 26.99,82.23 28.26,45.72 29.84,45.4 29.21,43.5 30.16,43.5 31.11,43.18 36.2,40.96 44.13,46.67 42.55,48.26 40.96,49.85 39.69,51.12 38.42,52.39 35.56,52.07 36.83,49.85 38.73,48.26 40.01,46.67 39.05,44.77 37.47,46.67 36.83,44.45 34.92,45.72 35.56,47.94 34.29,49.85 32.7,48.26 29.21,28.57 27.62,26.99 25.08,26.04 22.23,25.72 33.02,28.89 35.56,28.89 38.1,28.89 22.54,15.56 24.13,13.97 30.8,13.97 46.67,2.86 49.85,2.86 53.02,2.86 41.27,30.48 46.67,25.08 50.48,26.04 53.02,22.54 41.27,23.5 41.27,16.83 43.5,10.16 49.53,9.21 19.68,26.35 17.46,24.13 13.34,20 14.61,28.26 13.97,28.89 8.26,21.91 7.62,22.54 2.54,6.99 7.62,6.35 10.79,18.73 10.16,15.88 10.48,6.35 20.32,24.13 20,19.05 20.32,13.02 20,7.94 33.66,57.47 33.66,59.05
  pour Bottom (isolate 0.406, rank 3, no thermals): 0.32,87.31 4.13,87.31 6.03,89.22 9.84,89.22 11.43,87.63 11.43,86.04 13.34,84.14 13.34,80.64 15.88,78.11 15.88,71.75 9.21,65.09 0.32,65.09
  pour Top (isolate 0.406, rank 2, no thermals): 0.32,87.31 4.13,87.31 6.03,89.22 9.84,89.22 11.43,87.63 11.43,86.04 13.34,84.14 13.34,80.64 15.88,78.11 15.88,71.75 9.21,65.09 0.32,65.09
  pour Top (isolate 0.406, rank 3, no thermals): 13.34,67.94 16.83,71.44 16.83,74.93 26.99,74.93 29.53,72.39 29.53,62.23 26.04,58.74 14.92,58.74 13.34,60.33
  pour Bottom (isolate 0.406, rank 3, no thermals): 13.34,67.94 16.83,71.44 16.83,74.93 26.99,74.93 29.53,72.39 29.53,62.23 26.04,58.74 14.92,58.74 13.34,60.33
  pour Bottom (isolate 0.305, rank 2, no thermals): 15.24,93.03 34.61,93.03 34.61,99.69 38.1,99.69 38.1,96.2 43.5,90.81 60.64,90.81 62.55,92.71 63.82,92.71 65.09,91.44 65.09,86.68 59.05,80.96 42.23,80.96 40.01,78.74 30.16,78.74 20,88.9 15.24,88.9
  pour Bottom (isolate 0.305, rank 4): 13.97,88.9 20.32,88.9 24.45,84.77 23.5,84.77 23.18,84.45 29.84,77.79 40.32,77.79 42.55,80.01 68.58,80.01 81.92,66.67 81.92,47.62 78.42,44.13 78.42,32.38 75.88,29.84 73.98,28.26 73.98,22.86 55.56,22.86 45.4,33.02 45.4,51.12 50.8,56.52 50.8,67.94 49.21,69.53 33.66,69.53 27.3,75.88 18.41,75.88 18.41,79.06 15.88,81.6 15.88,84.77 13.97,86.68
  pour Top (isolate 0.305, rank 4): 13.97,87.95 19.68,87.95 29.84,77.79 40.32,77.79 42.55,80.01 68.58,80.01 81.92,66.67 81.92,47.62 78.42,44.13 78.42,32.38 75.88,29.84 60.33,29.84 54.93,35.24 54.93,63.82 49.21,69.53 33.66,69.53 27.3,75.88 18.41,75.88 18.41,79.06 15.88,81.6 15.88,84.77 13.97,86.68
  pour Bottom (isolate 0.305, rank 4, no thermals): 58.74,80.96 68.9,80.96 82.87,66.99 82.87,47.31 79.38,43.81 79.38,30.48 74.93,26.04 74.93,0.32 99.69,0.32 99.69,99.69 35.24,99.69 34.92,99.38 53.34,80.96
  pour Top (isolate 0.305, rank 2, no thermals): 12.06,93.03 34.61,93.03 34.61,99.69 38.1,99.69 38.1,96.2 43.5,90.81 60.64,90.81 62.55,92.71 63.82,92.71 65.09,91.44 65.09,86.68 59.05,80.96 42.23,80.96 40.01,78.74 30.16,78.74 20,88.9 13.97,88.9 11.75,91.12 11.75,92.71
  pour Bottom (no thermals): 14.61,90.81 14.61,93.98 33.66,93.98 33.66,99.69 12.38,99.69 12.38,92.08 12.06,91.76 13.02,90.81
  pour Bottom (isolate 0.305): 30.48,73.03 33.66,69.85 34.92,69.85 34.92,68.58 48.58,68.58 49.85,67.31 49.85,56.83 44.77,51.75 44.45,51.44 44.45,32.38 53.98,22.86 53.98,0.32 0.32,0.32 0.32,64.14 8.26,64.14 14.61,57.78 26.35,57.78 30.16,61.59 30.48,61.91
  pour Top (isolate 0.305): 30.48,73.03 33.66,69.85 34.92,69.85 34.92,68.58 48.58,68.58 49.85,67.31 49.85,56.83 44.45,51.44 44.45,43.18 53.98,33.66 53.98,0.32 0.32,0.32 0.32,64.14 8.26,64.14 14.61,57.78 26.35,57.78 30.48,61.91
HIGHSIDE_SUPPLY_CTRL
  Top 0.406: IC6.8 45.09,71.22 R43.1
LCD_CLK  (via drill 0.3)
  Top 0.305: U$1.P$78 26.64,41.91 v25.72,41.91 | v21.59,40.96 20.95,41.59 v6.03,41.59 4.77,41.59 DISPLAY.18 | DISPLAY.32 6,23.85 v6.03,23.81
  Bottom 0.305: v6.03,23.81 v6.03,41.59 | v25.72,41.91 25.08,41.91 24.13,40.96 v21.59,40.96
LCD_CS  (via drill 0.3)
  Top 0.305: U$1.P$95 33.26,36.51 32.62,36.51 25.72,29.61 v25.72,28.89 | DISPLAY.29 3.5,25.08 5.4,25.08 10.79,30.48 v24.13,30.48
  Bottom 0.305: v24.13,30.48 v25.72,28.89
LCD_MISO  (via drill 0.3)
  Top 0.305: U$1.P$79 26.71,41.27 v26.35,41.27 | DISPLAY.26 5.43,31.47 v7.3,33.34 8.89,34.92 v25.08,34.92 | DISPLAY.30 5.43,26.39 v7.3,28.26
  Bottom 0.305: v25.08,34.92 25.08,40.96 25.4,41.27 v26.35,41.27 | v7.3,28.26 v7.3,33.34
LCD_MOSI  (via drill 0.3)
  Top 0.305: U$1.P$80 26.78,40.64 v25.72,40.64 | DISPLAY.22 5.12,36.55 6.03,37.47 v6.67,37.47 7.3,37.47 v25.72,37.47 | DISPLAY.34 6.63,21.31 v6.67,21.27
  Bottom 0.305: v25.72,37.47 v25.72,40.64 | v6.67,21.27 v6.67,37.47
LCD_RD  (via drill 0.3)
  Top 0.305: U$1.P$66 29.61,50.16 v28.89,50.16
  Bottom 0.305: v28.89,50.16 23.18,50.16 21.27,48.26 5.71,48.26 5.56,48.1 3.34,48.1 DISPLAY.11
LCD_RESET  (via drill 0.3)
  Top 0.305: U$1.P$96 33.41,35.96 32.78,35.96 26.67,29.84 26.67,28.57 26.04,27.94 25.4,27.94 v25.08,28.26 | v23.18,29.84 13.34,29.84 6.03,22.54 3.42,22.54 DISPLAY.33
  Bottom 0.305: v25.08,28.26 23.5,29.84 v23.18,29.84
LCD_RS  (via drill 0.3)
  Top 0.305: U$1.P$64 29.84,51.34 v29.84,51.75
  Bottom 0.305: v29.84,51.75 22.86,51.75 20.64,49.53 8.89,49.53 5.4,53.02 3.5,53.02 DISPLAY.7
LCD_SD_CS  (via drill 0.3)
  Top 0.305: U$1.P$97 33.56,35.4 33.02,35.4 27.3,29.69 v27.3,29.21 | v16.83,29.21 6.39,18.77 DISPLAY.36
  Bottom 0.305: v27.3,29.21 24.77,26.67 23.81,26.67 23.18,27.3 18.73,27.3 v16.83,29.21
LCD_TOUCH_BUSY  (via drill 0.3)
  Top 0.305: DISPLAY.24 5.43,34.01 7.62,36.2 v24.13,36.2 | v24.13,31.75 24.96,31.75 U$1.P$90
  Bottom 0.305: v24.13,36.2 v24.13,31.75
LCD_TOUCH_CS  (via drill 0.3)
  Top 0.305: DISPLAY.20 22.82,39.09 v23.18,38.73 | U$1.P$89 24.89,32.38 v23.18,32.38
  Bottom 0.305: v23.18,32.38 v23.18,38.73
LCD_TOUCH_IRQ  (via drill 0.3)
  Top 0.305: DISPLAY.28 5.43,28.93 10.16,33.66 v22.23,33.66 | v22.23,32.07 23.18,31.11 25.04,31.11 U$1.P$91
  Bottom 0.305: v22.23,33.66 v22.23,32.07
LCD_WR  (via drill 0.3)
  Top 0.305: U$1.P$65 29.36,51.12 v29.21,51.12
  Bottom 0.305: v29.21,51.12 23.18,51.12 20.95,48.9 7.3,48.9 5.56,50.64 3.34,50.64 DISPLAY.9
LED1
  Top 0.305: U$1.P$2 39.69,34.43 39.69,10.79 42.86,7.62 47.62,7.62 48.26,6.99 R63.1
LED2
  Top 0.305: U$1.P$3 40.32,34.5 40.32,11.11 43.18,8.26 50.8,8.26 51.44,7.62 R65.1
LM2611_SW
  Top 1.27: L4.2 20.44,63.95 C37.2
  pour Top (isolate 0.305, rank 2, no thermals): 19.05,66.04 19.05,67.31 19.21,67.47 20.32,67.47 20.32,64.93 20.16,64.77 19.05,64.77
N$1
  Top 0.406: Q15.3 55.71,52.07 65.09,52.07 68.8,55.78 R30.1
N$2
  Top 0.813: R1.2 50.27,96.67 Q2.B
  Bottom 1.422: Q4.C 41.59,96.52 43.18,94.93 48.2,94.93 Q2.B
N$3  (via drill 0.3)
  Top 0.406: Q4.B 41.12,95.41 42.97,95.41 R2.1 | Q6.C 62.23,88.27 58.74,91.76 v46.04,91.76
  Bottom 0.406: v46.04,91.76 44.13,91.76 39.05,96.84 Q4.B
N$4
  Top 0.406: R47.1 R46.2 74.4,70.7 73.98,71.12 IC10.2
N$5
  Top 0.406: R8.2 82.55,71.12 83.19,70.48 83.19,65.41 80.11,62.33 R10.2
  Top 3.81: R3.1 R4.2 R9.2 R7.2 R8.2
N$6  (via drill 0.3)
  Top 0.813: R5.2 72.49,93.98 85.47,93.98 | Q5.E 70.17,70.66 v70.17,72.07 | v69.22,74.3 69.22,77.47
  Top 3.81: R4.1 69.22,77.47 70.17,77.47 85.47,92.77 85.47,93.98 Q1.E
  Bottom 0.813: v70.17,72.07 70.17,73.34 v69.22,74.3
N$7  (via drill 0.3)
  Top 0.813: R5.1 71.54,96.84 Q1.B
  Top 1.422: v83.82,86.36 88.9,91.44 v88.9,94.3 v89.85,94.3
  Bottom 1.422: Q3.C 93.98,95.25 93.03,94.3 v88.9,94.3 | Q1.B 74.55,95.63 v83.82,86.36 v84.45,87
N$8
  Top 0.406: 69.75,33.34 R22.2 C54.1 | 69.75,33.34 R23.1 | 69.75,33.34 IC4.8 IC4.1
N$9
  Top 0.813: Q3.B 91.44,94.3 | 91.44,94.3 91.44,92.71 90.81,92.08 90.81,90.49 84.77,84.45 80.96,84.45 69.05,72.54 Q5.C | R6.1 91.44,94.3
N$10
  Top 0.61: Q8.E 64.75,73.83 Q7.E
N$11  (via drill 0.3)
  Top 0.406: R49.2 58.63,44.77 75.56,44.77 80.33,49.53 v80.33,58.42 | v80.33,63.82 80.33,65.09 77.15,68.26 R46.1 75.14,69 74.3,69.85 73.66,69.85 72.71,68.9 IC10.6
  Bottom 0.406: v80.33,58.42 v80.33,63.82
N$12
  Top 0.406: Q14.E 60.18,70.8 D3.1
N$13
  Top 0.61: Q13.C 79.06,28.75 D4.2 92.31,28.75 K1.2
N$14
  Top 0.406: 78.11,64.03 78.11,62.55 77.48,61.92 IC13.3 | 78.11,64.03 R10.1 | R13.2 78.11,64.67 78.11,64.03
N$15
  Top 0.406: 78.95,60.96 R11.1 78.64,61.27 IC13.2 74.92,61.27 73.24,59.59 R12.2
N$16
  Top 0.406: IC2.3 66.78,41.59 R14.1 R17.1
N$17
  Top 0.406: IC2.2 66.78,40.32 R15.1 67.09,39.8 R16.2
N$18
  Top 0.406: R24.2 IC2.6 61.91,41.59 63.18,40.32 63.18,38.73 63.82,38.1 R16.1
N$20
  Top 0.406: IC1.3 66.78,49.21 R18.1 R21.1
N$21
  Top 0.406: IC1.2 66.78,47.94 R19.1 67.09,47.42 R20.2
N$22
  Top 0.406: R25.2 IC1.6 61.91,49.21 63.18,47.94 63.18,46.35 63.82,45.72 R20.1
N$23
  Top 0.406: IC5.3 67.73,35.88 C1.1 R23.2
N$24
  Top 0.305: 50.48,74.3 53.02,74.3
  Top 0.406: Q9.B 59.37,78.11 58.42,79.06 56.05,79.06 Q10.B 54.92,76.69 Q10.C 53.98,75.25 53.02,74.3 | Q11.C 49.53,75.25 50.48,74.3
N$25
  Top 0.406: Q12.B 46.03,76.83 | 46.03,76.83 46.03,76.69 Q12.C | Q11.B 50.48,77.15 50.16,76.83 47.31,76.83 | 47.31,76.83 46.03,76.83 | R28.1 47.31,76.83
N$26  (via drill 0.3)
  Top 0.406: Q13.B 73.34,29.53 68.26,24.45 v59.37,24.45 | v53.34,24.45 R31.2
  Bottom 0.406: v59.37,24.45 v53.34,24.45
N$27  (via drill 0.3)
  Top 0.305: U$1.P$76 25.86,42.55 v25.08,42.55 | v19.05,29.21 8.57,18.73 8.57,6.03 7.94,5.4 6.03,5.4 SWDIO.4
  Bottom 0.305: v25.08,42.55 24.77,42.55 24.13,41.91 21.27,41.91 20.64,41.27 20.64,28.89 20.32,28.57 19.68,28.57 v19.05,29.21
N$28
  Top 0.406: R26.1 51.75,76.66 Q10.E
N$29
  Top 0.406: R27.1 56.2,76.66 Q9.E
N$30
  Top 0.406: IC12.4 8.41,79 C32.1 C33.1
N$31  (via drill 0.3)
  Top 0.406: C5.2 64.87,59.37 IC7.8 v61.59,59.37 | v60.96,67.31 59.84,68.43 Q14.B
  Bottom 0.406: v61.59,59.37 62.23,60.01 62.23,66.04 v60.96,67.31
N$32
  Top 0.305: R97.1 29.84,13.67 D13.3 29.39,13.52 29.13,13.26 29.13,12.62 28.89,12.38 X1.3
N$33
  Top 0.305: U$1.P$12 42.55,38.64 42.55,37.15 43.4,36.3 Y1.3
  Top 0.406: Y1.3 43.92,36.05 C16.2
N$34
  Top 0.305: U$1.P$13 42.84,39.05 44.81,39.05 Y1.1 46.04,38 C15.2
N$35  (via drill 0.3)
  Top 0.305: U$1.P$72 28.89,46.64 v28.89,46.35 | v20,29.21 9.21,18.41 SWDIO.2
  Bottom 0.305: v28.89,46.35 28.57,46.67 26.04,46.67 21.91,42.55 20.32,42.55 20,42.23 v20,29.21
N$36
  Top 0.406: IC7.6 54.83,60.64 R33.2 R34.1
N$37
  Top 0.406: R33.1 54.83,59.37 IC7.7 59.37,59.37 60.01,60.01 60.01,63.82 59.37,64.45 IC7.3
N$38
  Top 0.406: IC7.14 63.82,66.99 | 63.82,66.99 64.87,66.99 C18.2 | D5.1 63.5,67.31 63.82,66.99
N$39
  Top 0.406: IC7.13 64.87,65.72 C18.1 66.99,65.51 67.09,65.41 | R48.2 C19.1 67.09,65.41 | 67.09,65.41 R35.1
N$40
  Top 0.406: C17.2 54.83,66.99 IC7.1 57.64,67.08 Q14.C
N$41
  Top 0.406: C21.2 21.91,90.39 21.91,94.61
  Top 1.778: IC8.1 15.56,93.03 17.14,94.61 21.91,94.61 25.72,94.61 25.88,94.46 | 25.88,94.46 L1.1 | D6.C 27.94,96.52 25.88,94.46
N$42
  Top 0.406: IC7.2 54.83,65.72 C17.1 54.08,65.51 53.34,64.77 53.34,57.78 53.98,57.15 C20.1 R36.1 R50.2
N$43
  Top 0.406: C21.1 20.32,89.85 IC8.3
N$44
  Top 0.254: 26.35,98.74 26.91,99.3 33.73,99.3 34.29,98.74
  Top 0.406: IC8.6 24.77,97.16 26.35,98.74 | 34.29,98.74 34.29,98.42 38.42,94.3 D9.3 | 41.59,94.13 D9.3 | D9.3 42.06,93.66 R38.1 42.86,93.56 R37.2
N$45
  Top 0.305: 38.73,76.2 38.73,78.11
  Top 0.406: R39.2 34.19,73.03 IC11.7 37.15,73.03 38.73,74.61 38.73,76.2 | 38.73,78.11 41.49,78.11 R68.1
N$46
  Top 0.406: R40.2 37.88,75.03 37.15,74.3 IC11.6 34.19,74.3 R39.1 33.02,73.56 33.02,72.07 33.66,71.44 33.66,71.12 34.61,70.17 R41.2
N$47
  Top 0.406: R41.1 39.59,71.33 40.01,71.75 IC11.1 43.28,71.75 R42.2
N$48
  Top 0.406: IC11.2 43.28,73.03 R42.1 R43.2
N$49
  Top 0.406: C33.2 11.11,82.92 R54.2
N$50
  Top 0.305: U$1.P$49 39.05,55.03 39.05,56.83 38.23,57.66 C27.1
N$51
  Top 0.305: U$1.P$73 27.2,47.62 26.99,47.62 26.35,46.99 24.32,46.99 C7.1
N$52
  Top 1.016: IC12.1 3.81,77.47 5.71,75.56 D10.C
  Top 1.676: L3.1 7.41,76.64 D10.C
N$53
  Top 0.406: C40.- 26.96,72.73 26.45,73.24 C39.1 R57.2
  Top 1.016: C40.- 27.04,68.02 31.87,68.02 L8.1
  Top 1.422: L5.2 26.96,65.95 C40.-
N$54
  Top 0.406: IC12.5 R53.2 R52.1
N$55
  Top 0.305: X1.2 D13.5 28.65,13.08 28.65,13.97 27.94,14.68 R64.1
N$56
  Top 1.27: D8.A 21.78,61.28 C37.1 24.57,61.15 L5.1
N$57
  Top 0.406: C39.2 R57.1 R56.2 21.91,70.8 20.32,69.21 IC9.3
N$58
  Top 0.406: R56.1 C38.1 R55.2
N$59
  Top 0.305: D13.4 27.43,13.52 27.29,13.65
  Top 0.406: X1.1 27.29,13.65 27.29,14.09 R98.1
N$60
  Top 0.305: X1.4 29.69,11.75 D13.1
  Top 0.406: R100.1 31.75,12.38 31.43,12.06 30.01,12.06 29.69,11.75
N$61
  Top 0.61: R66.2 2.01,11.33 0.87,12.46 0.87,14.99 2.11,16.23 DISPLAY.37
N$62  (via drill 0.3)
  Top 0.406: R68.2 41.91,81.28 v46.04,85.41 | C52.2 R37.1 42.86,88.58 v43.18,88.27
  Bottom 0.406: v46.04,85.41 v43.18,88.27
N$63
  Top 0.305: U$1.P$55 29.76,57.78 8.89,57.78 DISPLAY.2
N$64
  Top 0.305: U$1.P$56 30.33,56.52 27.3,56.52 21.91,51.12 13.02,51.12 DISPLAY.4
N$65
  Top 0.305: U$1.P$57 30.25,55.88 27.62,55.88 22.23,50.48 11.12,50.48 DISPLAY.6
N$66
  Top 0.305: U$1.P$58 30.18,55.24 27.94,55.24 22.54,49.85 9.21,49.85 DISPLAY.8
N$67
  Top 0.305: U$1.P$59 30.11,54.61 28.26,54.61 22.86,49.21 7.31,49.21 DISPLAY.10
N$68
  Top 0.305: U$1.P$60 30.04,53.98 28.57,53.98 23.18,48.58 5.4,48.58 DISPLAY.12
N$69
  Top 0.305: U$1.P$61 29.97,53.34 28.89,53.34 23.5,47.94 5.88,47.94 4.73,46.79 DISPLAY.14
N$70  (via drill 0.3)
  Top 0.305: U$1.P$62 30.19,52.41 29.23,52.41 26.04,49.21 v26.04,47.94 | v19.37,44.13 4.77,44.13 DISPLAY.16
  Bottom 0.305: v26.04,47.94 22.23,44.13 v19.37,44.13
N$71
  Top 0.406: LED1.A R63.2
N$72
  Top 0.406: LED2.A R65.2
N$73
  Top 2.54: 70.17,17.78 70.17,18.54 L6.1
  Top 3.81: K1.S 81.6,17.78 70.8,17.78 70.17,18.41 | 70.17,18.41 70.17,19.68 | 70.17,18.41 70.17,17.78
N$74
  Top 0.305: U$1.P$29 51.19,53.02 52.07,53.02 53.02,53.98 R69.1
N$75
  Top 0.305: DISPLAY.19 3.5,37.78 5.4,37.78 5.71,38.1 27.07,38.1 U$1.P$84
N$76
  Top 0.305: U$1.P$83 27,38.73 24.13,38.73 22.54,40.32 3.5,40.32 DISPLAY.17
N$77
  Top 0.305: U$1.P$82 26.93,39.37 24.45,39.37 20.95,42.86 3.5,42.86 DISPLAY.15
N$78
  Top 0.305: U$1.P$81 26.86,40.01 24.77,40.01 19.21,45.56 3.34,45.56 DISPLAY.13
N$79
  Top 0.305: U$1.P$30 51.12,53.66 R70.1
N$80
  Top 0.305: U$1.P$46 44.13,57.99 R71.2
N$83
  Top 0.305: DISPLAY.21 3.5,35.24 5.4,35.24 6.99,36.83 26.51,36.83 U$1.P$85
N$84
  Top 0.305: DISPLAY.23 3.5,32.7 5.4,32.7 8.26,35.56 25.95,35.56 U$1.P$86
N$85
  Top 0.305: DISPLAY.25 3.5,30.16 5.4,30.16 9.53,34.29 25.38,34.29 U$1.P$87
N$86
  Top 0.305: DISPLAY.27 3.5,27.62 5.4,27.62 10.79,33.02 24.82,33.02 U$1.P$88
NRST  (via drill 0.3)
  Top 0.305: U$1.P$14 41.64,40.96 v41.59,40.96 | v36.83,33.12 36.83,30.58 | SWDIO.1 11.75,20 20.95,29.21 v22.23,29.21 | v24.13,27.3 26.35,27.3 v29.21,30.16 | v34.29,30.48 34.39,30.58 R32.1
  Top 0.406: C14.1 36.83,30.58 R32.1
  Bottom 0.305: v41.59,40.96 40.64,40.96 37.47,37.78 37.47,34.92 36.83,34.29 v36.83,33.12 | v22.23,29.21 v24.13,27.3 | v29.21,30.16 33.97,30.16 v34.29,30.48
OUTPUT_ENABLE
  Top 0.305: U$1.P$5 40.96,35.28 40.96,32.07 48.36,24.66 R31.1
PUSHPULL_CTRL
  Top 0.61: D3.2 D5.2 65.7,71.58 Q8.C 66.68,71.61 | Q5.B 66.68,71.61 | Q8.B 66.68,71.61
PUSHPULL_OUT  (via drill 0.3)
  Top 0.406: R29.2 C6.2 68.8,59.79 v68.9,59.69 | R60.1 58.74,30.16 59.05,29.84 59.05,27.94 59.69,27.3 68.9,27.3 73.34,31.75 78.11,31.75 83.19,36.83 R8.1 83.19,56.83 80.86,59.16 R11.2 78.64,58.74 75.25,58.74 74.61,59.37 v74.61,59.69
  Top 1.27: C28.2 83.06,40.77 R8.1
  Top 3.81: R8.1 R7.1 | R7.1 R9.1 | R7.1 90.17,40.32 K1.P
  Bottom 0.406: v68.9,59.69 v74.61,59.69
RX
  Top 0.305: U$1.P$93 21.27,25.94 UART.3
SWITCH
  Top 0.305: U$1.P$1 39.01,34.39 39.01,6.71 39.37,6.35 39.37,3.56 S1.1
TX
  Top 0.305: U$1.P$92 18.73,24.11 UART.2
USB_ID  (via drill 0.3)
  Top 0.305: v35.24,39.05 35.24,42.41 U$1.P$69
  Top 0.406: R100.2 31.11,17.68 31.11,29.84 v34.61,33.34
  Bottom 0.406: v34.61,33.34 35.24,33.97 v35.24,39.05
USB_VBUS  (via drill 0.3)
  Top 0.305: U$1.P$68 39.62,38.73 v39.69,38.73
  Top 0.406: C10.1 26.01,17.07 R98.2 26.04,17.78 26.99,18.73 v27.62,18.73 | v32.07,18.73 32.07,29.53 34.61,32.07 v34.61,32.38
  Bottom 0.305: v34.61,32.38 37.15,32.38 38.1,33.34 38.1,37.15 v39.69,38.73
  Bottom 0.406: v32.07,18.73 v27.62,18.73
USBD_N  (via drill 0.3)
  Top 0.152: 32.93,43.91 32.86,43.98
  Top 0.305: R64.2 28.66,17.77 28.66,18.19 29.93,19.46 29.93,30.89 33.18,34.13 v32.98,34.33 | v34,40.29 34.13,40.17 33.88,39.92 33.43,39.92 32.93,40.42 32.93,43.91 32.93,44.01 U$1.P$70
  Bottom 0.305: v34,40.29 34.13,40.17 33.74,39.78 33.74,34.7 33.18,34.13 v32.98,34.33
USBD_P  (via drill 0.3)
  Top 0.305: R97.2 29.12,17.77 29.12,18 30.39,19.27 30.39,30.7 33.5,33.81 v33.7,33.61 | v34.58,39.72 34.45,39.84 34.07,39.46 33.24,39.46 32.47,40.23 32.47,43.76 U$1.P$71
  Bottom 0.305: v34.58,39.72 34.45,39.84 34.2,39.59 34.2,34.51 33.5,33.81 v33.7,33.61
VDDA  (via drill 0.3)
  Top 0.305: U$1.P$22 50.72,37.53 L2.2
  Top 0.406: L2.2 49.23,33.15 C30.1 C31.1 49.11,30.27 v49.85,29.53 | R22.1 66.04,32.38 61.91,28.26 v60.01,28.26
  Bottom 0.406: v60.01,28.26 54.93,28.26 53.98,27.3 52.07,27.3 v49.85,29.53
VIN
  Top 1.016: C34.2 3.56,83.95 IC12.8 | 8.13,92.52 13.97,86.68 L9.1
  Top 1.422: PAD1.1 1.59,90.17 C34.2
  Top 2.54: IC8.2 14.61,97.16 13.34,95.89 C49.1 11.88,95.38 9.02,92.52 8.13,92.52 7.75,92.52 C24.+ 6.35,91.12 PAD1.1
VOLTAGE_CTRL  (via drill 0.3)
  Top 0.406: IC7.10 61.91,61.91 60.96,60.96 60.96,59.69 59.37,58.1 v54.29,58.1 | R69.2 52.55,56.25 v52.55,58.1
  Bottom 0.406: v54.29,58.1 v52.55,58.1
VOLTAGE_FEEDBACK
  Top 0.406: IC7.9 64.87,60.64 C5.1 66.99,60.86 67.09,60.96 | R29.1 67.09,60.96 | 67.09,60.96 C6.1 R44.2 R30.2
VOLTAGE_RANGE_SEL  (via drill 0.3)
  Top 0.305: Q15.1 v51.44,52.07 | U$1.P$38 42.92,51.12 47.31,51.12 v49.85,53.66
  Bottom 0.305: v51.44,52.07 v49.85,53.66
VOUT_HIGHSIDE
  Top 0.406: Q6.E 62.08,79.38 60.96,79.38 60.33,80.01 43.81,80.01 43.18,79.38 43.18,77.79 42.55,77.15 R40.1
  Top 0.813: R1.1 57.53,93.34 Q2.E | Q6.E 63.18,78.74 66.04,81.6 R3.2
  Top 3.81: R3.2 67.63,85.72 67.63,92.71 63.5,96.84 Q2.E
VREF  (via drill 0.3)
  Top 0.305: U$1.P$21 49.53,38.02 v49.53,37.78 | v53.02,37.15 53.66,37.78 C29.1
  Top 0.406: C29.1 R51.1 C22.1
  Bottom 0.305: v49.53,37.78 50.16,37.15 v53.02,37.15
VSUPPLY_HIGHSIDE  (via drill 0.3)
  Top 0.406: C26.+ 58.74,87.31 60.33,87.31 61.28,86.36 61.28,81.28 v60.96,80.96 | v63.5,76.2 63.5,75.25 63.18,74.93 62.55,74.93 62.23,74.61 62.23,73.03 61.91,72.71 59.37,72.71 57.78,71.12 55.66,71.12 R58.1
  Top 1.016: Q4.E 44.66,96.94 R2.2 R38.2 44.66,90.27 C25.+
  Top 2.54: L1.2 39.57,81.8 46.04,88.27 C25.+
  Bottom 0.406: v60.96,80.96 60.96,78.74 v63.5,76.2
  Bottom 2.54: C25.+ C26.+ 55.88,88.27 55.56,88.58 Q2.C
VSUPPLY_LOWSIDE
  Top 0.406: IC10.3 72.71,74.61 81.28,83.19 86.04,83.19 R45.2
  Top 0.813: R6.2 96.2,94.3 96.52,94.61
  Top 1.27: Q3.E 96.52,94.61 96.52,93.66 R45.2
  Bottom 3.81: R45.2 83.82,90.81 80.01,94.61 Q1.C

## Text on the board
tDocu: +- | VCC | CLK | GND | DIO | RST | GND | TX | RX